# Altium schematic sheet LIDO-HW.100.Page_9.SchDoc
size A3; SheetNumber: 13; SheetTotal: 14
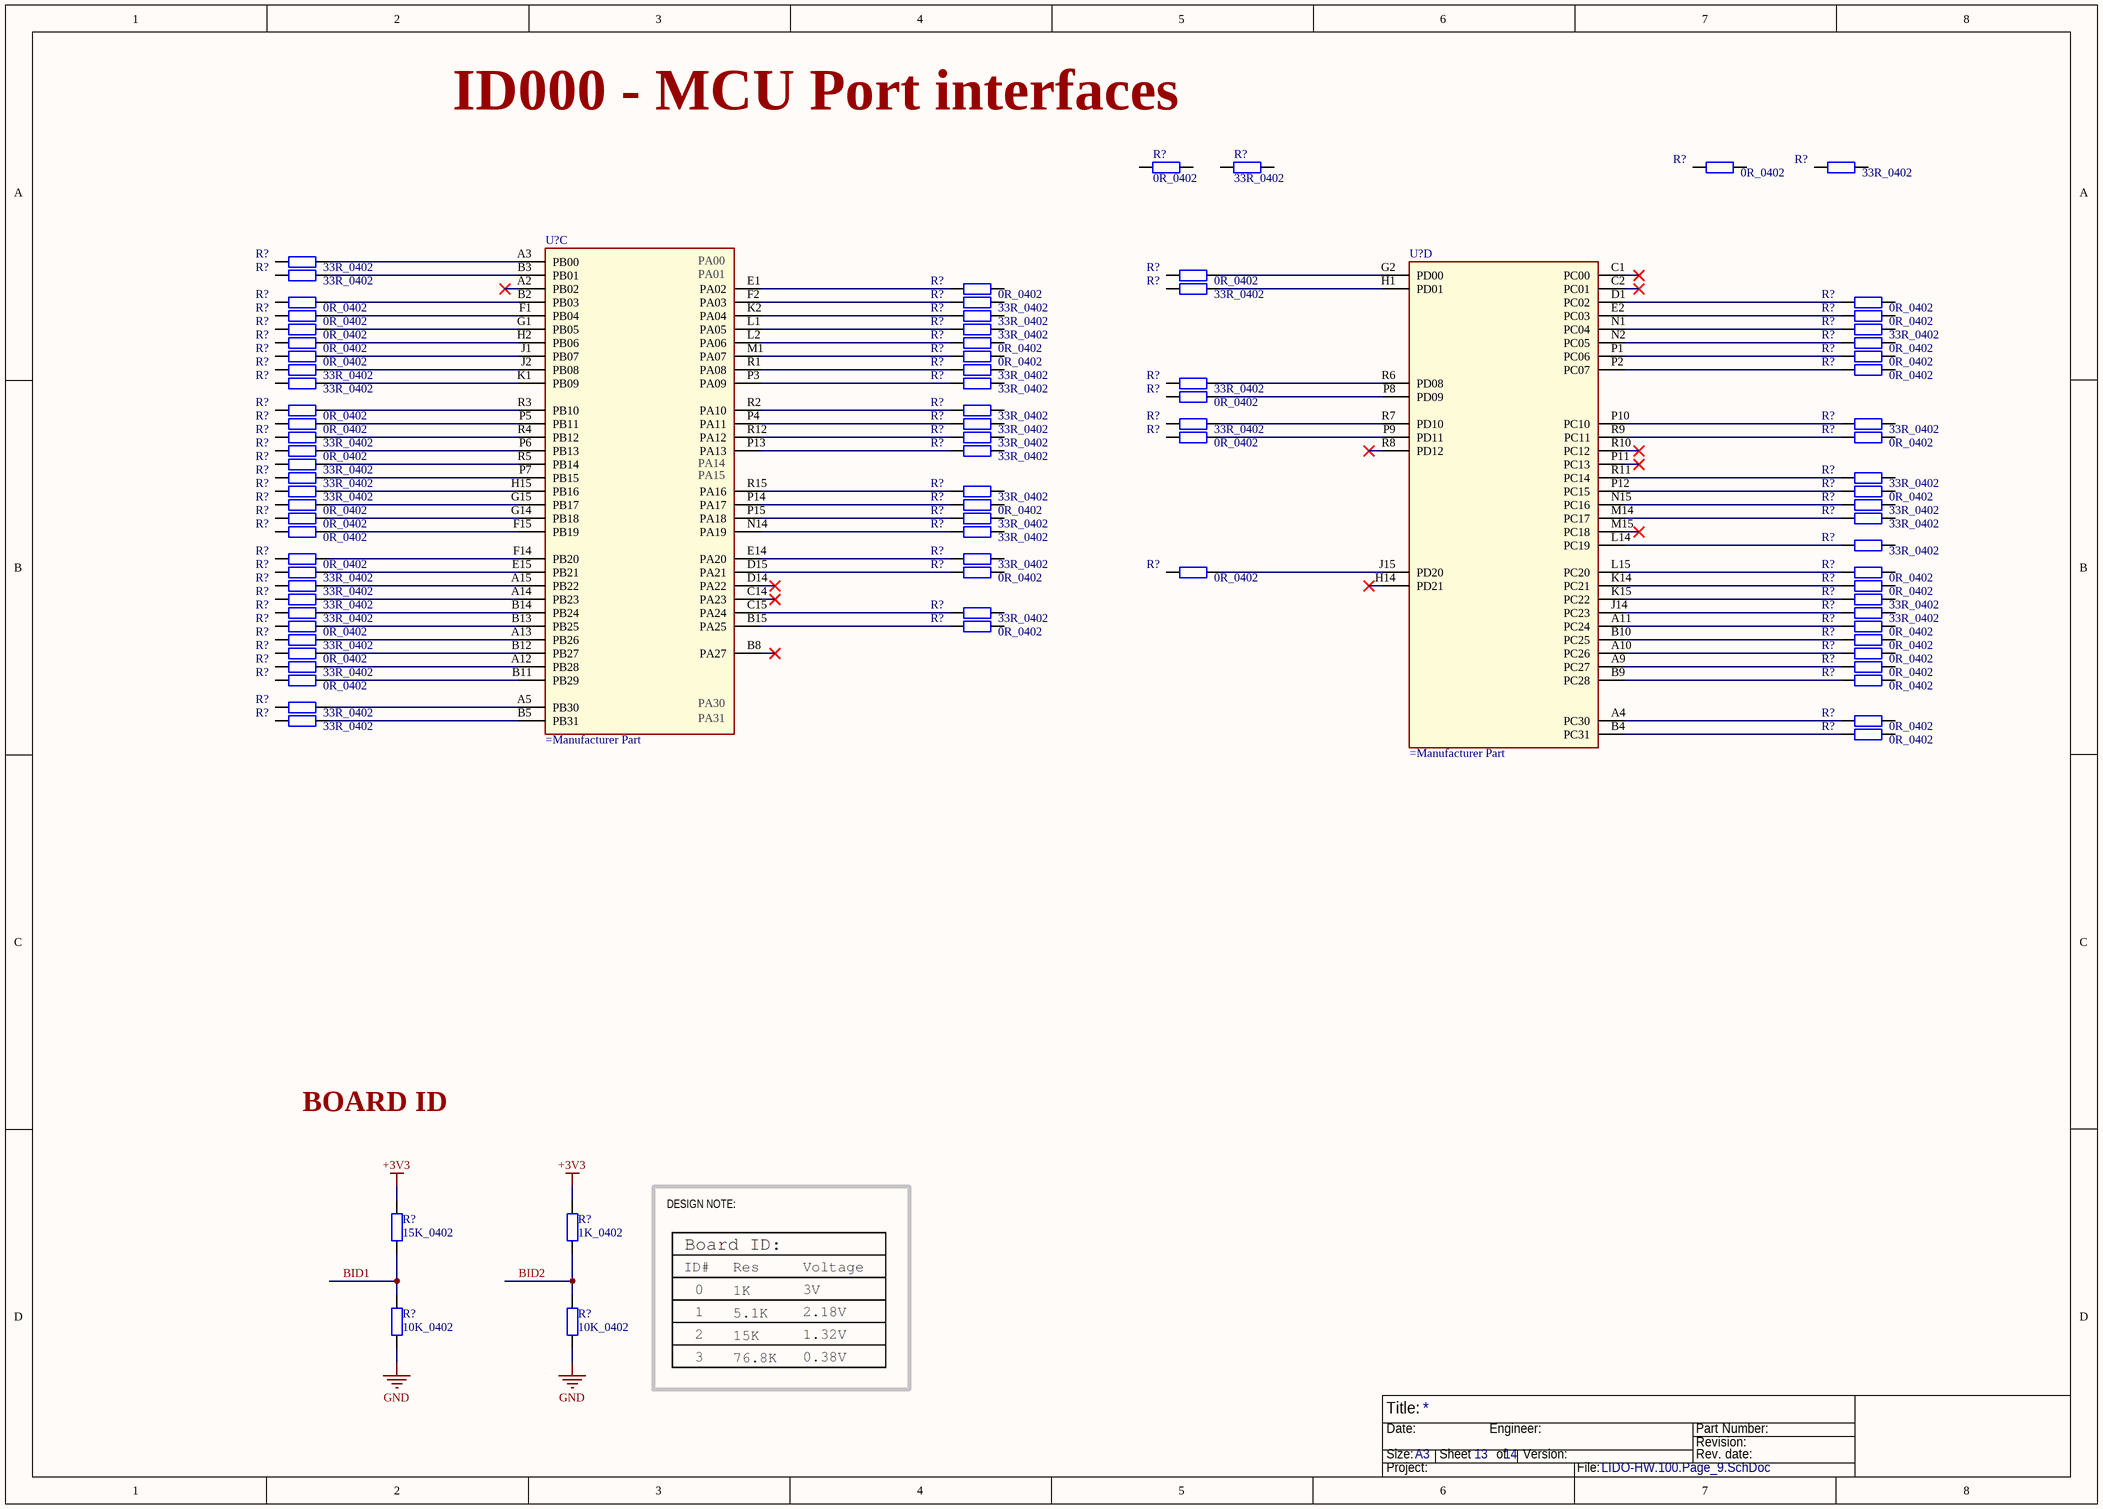
[diagram p0: LIDO-HW.100.Page_9.SchDoc]

## Parts
(Parts that share a designator on the sheet are numbered #1, #2 ... from top to bottom, then left to right.)
R?#1  0R_0402
R?#2  33R_0402
R?#3  0R_0402
R?#4  33R_0402
R?#5  33R_0402
R?#6  33R_0402
R?#7  0R_0402
R?#8  0R_0402
R?#9  33R_0402
R?#10  0R_0402
R?#11  33R_0402
R?#12  0R_0402
R?#13  0R_0402
R?#14  33R_0402
R?#15  0R_0402
R?#16  0R_0402
R?#17  33R_0402
R?#18  33R_0402
R?#19  0R_0402
R?#20  0R_0402
R?#21  0R_0402
R?#22  0R_0402
R?#23  0R_0402
R?#24  0R_0402
R?#25  33R_0402
R?#26  33R_0402
R?#27  0R_0402
R?#28  33R_0402
R?#29  33R_0402
R?#30  33R_0402
R?#31  0R_0402
R?#32  0R_0402
R?#33  33R_0402
R?#34  0R_0402
R?#35  33R_0402
R?#36  33R_0402
R?#37  33R_0402
R?#38  33R_0402
R?#39  33R_0402
R?#40  0R_0402
R?#41  0R_0402
R?#42  0R_0402
R?#43  33R_0402
R?#44  33R_0402
R?#45  33R_0402
R?#46  33R_0402
R?#47  33R_0402
R?#48  33R_0402
R?#49  0R_0402
R?#50  0R_0402
R?#51  0R_0402
R?#52  33R_0402
R?#53  0R_0402
R?#54  33R_0402
R?#55  33R_0402
R?#56  0R_0402
R?#57  33R_0402
R?#58  33R_0402
R?#59  0R_0402
R?#60  33R_0402
R?#61  33R_0402
R?#62  0R_0402
R?#63  0R_0402
R?#64  0R_0402
R?#65  33R_0402
R?#66  0R_0402
R?#67  33R_0402
R?#68  33R_0402
R?#69  33R_0402
R?#70  33R_0402
R?#71  33R_0402
R?#72  0R_0402
R?#73  0R_0402
R?#74  0R_0402
R?#75  33R_0402
R?#76  0R_0402
R?#77  0R_0402
R?#78  0R_0402
R?#79  33R_0402
R?#80  0R_0402
R?#81  0R_0402
R?#82  0R_0402
R?#83  33R_0402
R?#84  33R_0402
R?#85  0R_0402
R?#86  0R_0402
R?#87  15K_0402
R?#88  1K_0402
R?#89  10K_0402
R?#90  10K_0402
U?#1  (no value)  (part C of 4)
U?#2  (no value)  (part D of 4)

## Nets
+3V3: R?#87.2 R?#88.2
GND: R?#89.1 R?#90.1
BID1: R?#87.1 R?#89.2
BID2: R?#88.1 R?#90.2
NetR?#5_1: R?#5.1 U?#1.A3(PB00)
NetR?#6_1: R?#6.1 U?#1.B3(PB01)
NetR?#7_1: R?#7.1 U?#2.G2(PD00)
NetR?#8_2: R?#8.2 U?#1.E1(PA02)
NetR?#9_1: R?#9.1 U?#2.H1(PD01)
NetR?#10_1: R?#10.1 U?#1.B2(PB03)
NetR?#11_2: R?#11.2 U?#1.F2(PA03)
NetR?#12_2: R?#12.2 U?#2.D1(PC02)
NetR?#13_1: R?#13.1 U?#1.F1(PB04)
NetR?#14_2: R?#14.2 U?#1.K2(PA04)
NetR?#15_2: R?#15.2 U?#2.E2(PC03)
NetR?#16_1: R?#16.1 U?#1.G1(PB05)
NetR?#17_2: R?#17.2 U?#1.L1(PA05)
NetR?#18_2: R?#18.2 U?#2.N1(PC04)
NetR?#19_1: R?#19.1 U?#1.H2(PB06)
NetR?#20_2: R?#20.2 U?#1.L2(PA06)
NetR?#21_2: R?#21.2 U?#2.N2(PC05)
NetR?#22_1: R?#22.1 U?#1.J1(PB07)
NetR?#23_2: R?#23.2 U?#1.M1(PA07)
NetR?#24_2: R?#24.2 U?#2.P1(PC06)
NetR?#25_1: R?#25.1 U?#1.J2(PB08)
NetR?#26_2: R?#26.2 U?#1.R1(PA08)
NetR?#27_2: R?#27.2 U?#2.P2(PC07)
NetR?#28_1: R?#28.1 U?#1.K1(PB09)
NetR?#29_2: R?#29.2 U?#1.P3(PA09)
NetR?#30_1: R?#30.1 U?#2.R6(PD08)
NetR?#31_1: R?#31.1 U?#2.P8(PD09)
NetR?#32_1: R?#32.1 U?#1.R3(PB10)
NetR?#33_2: R?#33.2 U?#1.R2(PA10)
NetR?#34_1: R?#34.1 U?#1.P5(PB11)
NetR?#35_2: R?#35.2 U?#1.P4(PA11)
NetR?#36_1: R?#36.1 U?#2.R7(PD10)
NetR?#37_2: R?#37.2 U?#2.P10(PC10)
NetR?#38_1: R?#38.1 U?#1.R4(PB12)
NetR?#39_2: R?#39.2 U?#1.R12(PA12)
NetR?#40_1: R?#40.1 U?#2.P9(PD11)
NetR?#41_2: R?#41.2 U?#2.R9(PC11)
NetR?#42_1: R?#42.1 U?#1.P6(PB13)
NetR?#43_2: R?#43.2 U?#1.P13(PA13)
NetR?#44_1: R?#44.1 U?#1.R5(PB14)
NetR?#45_1: R?#45.1 U?#1.P7(PB15)
NetR?#46_2: R?#46.2 U?#2.R11(PC14)
NetR?#47_1: R?#47.1 U?#1.H15(PB16)
NetR?#48_2: R?#48.2 U?#1.R15(PA16)
NetR?#49_2: R?#49.2 U?#2.P12(PC15)
NetR?#50_1: R?#50.1 U?#1.G15(PB17)
NetR?#51_2: R?#51.2 U?#1.P14(PA17)
NetR?#52_2: R?#52.2 U?#2.N15(PC16)
NetR?#53_1: R?#53.1 U?#1.G14(PB18)
NetR?#54_2: R?#54.2 U?#1.P15(PA18)
NetR?#55_2: R?#55.2 U?#2.M14(PC17)
NetR?#56_1: R?#56.1 U?#1.F15(PB19)
NetR?#57_2: R?#57.2 U?#1.N14(PA19)
NetR?#58_2: R?#58.2 U?#2.L14(PC19)
NetR?#59_1: R?#59.1 U?#1.F14(PB20)
NetR?#60_2: R?#60.2 U?#1.E14(PA20)
NetR?#61_1: R?#61.1 U?#1.E15(PB21)
NetR?#62_2: R?#62.2 U?#1.D15(PA21)
NetR?#63_1: R?#63.1 U?#2.J15(PD20)
NetR?#64_2: R?#64.2 U?#2.L15(PC20)
NetR?#65_1: R?#65.1 U?#1.A15(PB22)
NetR?#66_2: R?#66.2 U?#2.K14(PC21)
NetR?#67_1: R?#67.1 U?#1.A14(PB23)
NetR?#68_2: R?#68.2 U?#2.K15(PC22)
NetR?#69_1: R?#69.1 U?#1.B14(PB24)
NetR?#70_2: R?#70.2 U?#1.C15(PA24)
NetR?#71_2: R?#71.2 U?#2.J14(PC23)
NetR?#72_1: R?#72.1 U?#1.B13(PB25)
NetR?#73_2: R?#73.2 U?#1.B15(PA25)
NetR?#74_2: R?#74.2 U?#2.A11(PC24)
NetR?#75_1: R?#75.1 U?#1.A13(PB26)
NetR?#76_2: R?#76.2 U?#2.B10(PC25)
NetR?#77_1: R?#77.1 U?#1.B12(PB27)
NetR?#78_2: R?#78.2 U?#2.A10(PC26)
NetR?#79_1: R?#79.1 U?#1.A12(PB28)
NetR?#80_2: R?#80.2 U?#2.A9(PC27)
NetR?#81_1: R?#81.1 U?#1.B11(PB29)
NetR?#82_2: R?#82.2 U?#2.B9(PC28)
NetR?#83_1: R?#83.1 U?#1.A5(PB30)
NetR?#84_1: R?#84.1 U?#1.B5(PB31)
NetR?#85_2: R?#85.2 U?#2.A4(PC30)
NetR?#86_2: R?#86.2 U?#2.B4(PC31)

Not connected (* = marked no-connect by the designer): R?#1 1 2; R?#2 1 2; R?#3 1 2; R?#4 1 2; R?#5 2; R?#6 2; R?#7 2; R?#8 1; R?#9 2; R?#10 2; R?#11 1; R?#12 1; R?#13 2; R?#14 1; R?#15 1; R?#16 2; R?#17 1; R?#18 1; R?#19 2; R?#20 1; R?#21 1; R?#22 2; R?#23 1; R?#24 1; R?#25 2; R?#26 1; R?#27 1; R?#28 2; R?#29 1; R?#30 2; R?#31 2; R?#32 2; R?#33 1; R?#34 2; R?#35 1; R?#36 2; R?#37 1; R?#38 2; R?#39 1; R?#40 2; R?#41 1; R?#42 2; R?#43 1; R?#44 2; R?#45 2; R?#46 1; R?#47 2; R?#48 1; R?#49 1; R?#50 2; R?#51 1; R?#52 1; R?#53 2; R?#54 1; R?#55 1; R?#56 2; R?#57 1; R?#58 1; R?#59 2; R?#60 1; R?#61 2; R?#62 1; R?#63 2; R?#64 1; R?#65 2; R?#66 1; R?#67 2; R?#68 1; R?#69 2; R?#70 1; R?#71 1; R?#72 2; R?#73 1; R?#74 1; R?#75 2; R?#76 1; R?#77 2; R?#78 1; R?#79 2; R?#80 1; R?#81 2; R?#82 1; R?#83 2; R?#84 2; R?#85 1; R?#86 1; U?#1 A2(PB02)* B8(PA27)* C14(PA23)* D14(PA22)*; U?#2 C1(PC00)* C2(PC01)* H14(PD21)* M15(PC18)* P11(PC13)* R8(PD12)* R10(PC12)*

## Notes on the sheet
- (near R?#1) ID000 - MCU Port interfaces
- BOARD ID
- DESIGN NOTE:
- Title:
- Size:
- Date:
- A3
- Sheet       of
- Engineer:
- Version:
- Part Number:
- Revision:
- Rev. date:
- Project:
- File:
- (in symbol ATMEL_ATSAME54P20A-CT_A, part C) PA00; PA01; PA14; PA15; PA30; PA31

## Library data of the parts
R?#1-R?#90 = Resistor: Resistor Symbol
U?#1 U?#2 = ATMEL_ATSAME54P20A-CT_A: 32-bit ARM® Cortex®-M4F MCUs with 1 Msps 12-bit ADC, / QSPI, USB, Ethernet, and PTC